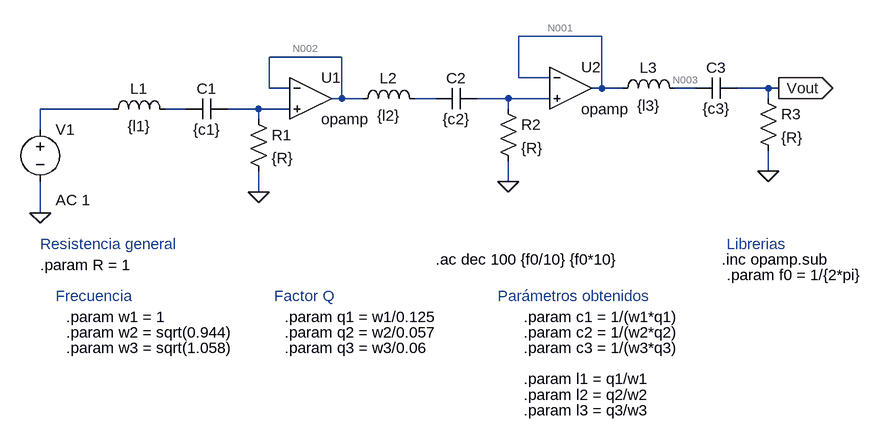
[diagram p0: schematic tarea4.asc]
tarea4.asc, the LTspice schematic file:
Version 4
SHEET 1 1196 992
WIRE 768 16 640 16
WIRE 368 48 256 48
WIRE 640 80 640 16
WIRE 688 80 640 80
WIRE 256 96 256 48
WIRE 288 96 256 96
WIRE 768 96 768 16
WIRE 768 96 752 96
WIRE 800 96 768 96
WIRE 912 96 880 96
WIRE 1024 96 976 96
WIRE 1040 96 1024 96
WIRE 368 112 368 48
WIRE 368 112 352 112
WIRE 400 112 368 112
WIRE 512 112 480 112
WIRE 624 112 576 112
WIRE 688 112 624 112
WIRE 1024 112 1024 96
WIRE 16 128 -96 128
WIRE 128 128 96 128
WIRE 240 128 192 128
WIRE 288 128 240 128
WIRE 624 128 624 112
WIRE 240 144 240 128
WIRE -96 160 -96 128
WIRE 1024 224 1024 192
WIRE 624 240 624 208
WIRE 240 256 240 224
WIRE -96 288 -96 240
FLAG 240 256 0
FLAG 624 240 0
FLAG 1024 224 0
FLAG -96 288 0
FLAG 1040 96 Vout
IOPIN 1040 96 Out
SYMBOL ind 0 144 R270
WINDOW 0 32 56 VTop 2
WINDOW 3 5 56 VBottom 2
SYMATTR InstName L1
SYMATTR Value {l1}
SYMBOL cap 192 112 R90
WINDOW 0 0 32 VBottom 2
WINDOW 3 32 32 VTop 2
SYMATTR InstName C1
SYMATTR Value {c1}
SYMBOL res 224 128 R0
SYMATTR InstName R1
SYMATTR Value {R}
SYMBOL ind 384 128 R270
WINDOW 0 32 56 VTop 2
WINDOW 3 5 56 VBottom 2
SYMATTR InstName L2
SYMATTR Value {l2}
SYMBOL cap 576 96 R90
WINDOW 0 0 32 VBottom 2
WINDOW 3 32 32 VTop 2
SYMATTR InstName C2
SYMATTR Value {c2}
SYMBOL res 608 112 R0
SYMATTR InstName R2
SYMATTR Value {R}
SYMBOL OpAmps\\opamp 320 48 R0
SYMATTR InstName U1
SYMBOL ind 784 112 R270
WINDOW 0 32 56 VTop 2
WINDOW 3 5 56 VBottom 2
SYMATTR InstName L3
SYMATTR Value {l3}
SYMBOL cap 976 80 R90
WINDOW 0 0 32 VBottom 2
WINDOW 3 32 32 VTop 2
SYMATTR InstName C3
SYMATTR Value {c3}
SYMBOL res 1008 96 R0
SYMATTR InstName R3
SYMATTR Value {R}
SYMBOL OpAmps\\opamp 720 32 R0
SYMATTR InstName U2
SYMBOL voltage -96 144 R0
WINDOW 123 24 124 Left 2
WINDOW 39 0 0 Left 0
SYMATTR Value2 AC 1
SYMATTR InstName V1
SYMATTR Value ""
TEXT 952 360 Left 2 !.inc opamp.sub
TEXT 960 336 Left 2 ;Librerias
TEXT 608 416 Left 2 ;Parámetros obtenidos
TEXT -96 368 Left 2 !.param R = 1
TEXT -96 336 Left 2 ;Resistencia general
TEXT -72 416 Left 2 ;Frecuencia
TEXT -56 448 Left 2 !.param w1 = 1
TEXT -56 472 Left 2 !.param w2 = sqrt(0.944)
TEXT -56 496 Left 2 !.param w3 = sqrt(1.058)
TEXT 264 416 Left 2 ;Factor Q
TEXT 280 448 Left 2 !.param q1 = w1/0.125
TEXT 280 472 Left 2 !.param q2 = w2/0.057
TEXT 280 496 Left 2 !.param q3 = w3/0.06
TEXT 648 448 Left 2 !.param c1 = 1/(w1*q1)
TEXT 648 472 Left 2 !.param c2 = 1/(w2*q2)
TEXT 648 496 Left 2 !.param c3 = 1/(w3*q3)
TEXT 648 544 Left 2 !.param l1 = q1/w1
TEXT 648 568 Left 2 !.param l2 = q2/w2
TEXT 648 592 Left 2 !.param l3 = q3/w3
TEXT 512 360 Left 2 !.ac dec 100 {f0/10} {f0*10}
TEXT 960 384 Left 2 !.param f0 = 1/{2*pi}

The netlist it stands for:
* tarea4.asc
L1 N006 N007 {l1}
C1 N008 N007 {c1}
R1 N008 0 {R}
L2 N002 N004 {l2}
C2 N005 N004 {c2}
R2 N005 0 {R}
XU1 N002 N008 N002 opamp Aol=100K GBW=10Meg  ; pins invin noninvin out
L3 N001 N003 {l3}
C3 Vout N003 {c3}
R3 Vout 0 {R}
XU2 N001 N005 N001 opamp Aol=100K GBW=10Meg  ; pins invin noninvin out
V1 N006 0 AC 1
.inc opamp.sub
* Librerias
* Parámetros obtenidos
.param R = 1
* Resistencia general
* Frecuencia
.param w1 = 1
.param w2 = sqrt(0.944)
.param w3 = sqrt(1.058)
* Factor Q
.param q1 = w1/0.125
.param q2 = w2/0.057
.param q3 = w3/0.06
.param c1 = 1/(w1*q1)
.param c2 = 1/(w2*q2)
.param c3 = 1/(w3*q3)
.param l1 = q1/w1
.param l2 = q2/w2
.param l3 = q3/w3
.ac dec 100 {f0/10} {f0*10}
.param f0 = 1/{2*pi}
.backanno
.end

* Results of the author's LTspice run, read from the files saved beside the schematic
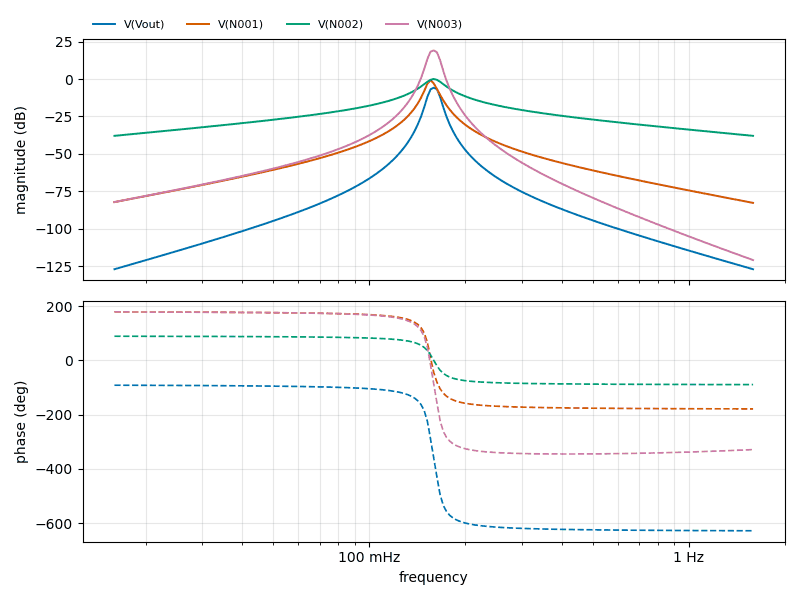
[diagram p1: AC Analysis of tarea4.asc, plotted from the saved traces]
* AC Analysis, 1 run:
*   V(Vout): -127.11 dB at 15.92 mHz, -127.12 dB at 1.592 Hz, peak -5.82 dB at 159.2 mHz, 3 dB below the peak at 154.1 mHz and 164.3 mHz
*   V(N001): -82.26 dB at 15.92 mHz, -82.78 dB at 1.592 Hz, peak -0.74 dB at 155.5 mHz, 3 dB below the peak at 151.6 mHz and 159.9 mHz
*   V(N002): -37.98 dB at 15.92 mHz, -37.98 dB at 1.592 Hz, peak -0.01 dB at 159.2 mHz, 3 dB below the peak at 149.5 mHz and 169.4 mHz
*   V(N003): -82.18 dB at 15.92 mHz, -120.98 dB at 1.592 Hz, peak 19.12 dB at 159.2 mHz, 3 dB below the peak at 153.9 mHz and 164.1 mHz